# Altium project Brduino-Nano.PrjPcb
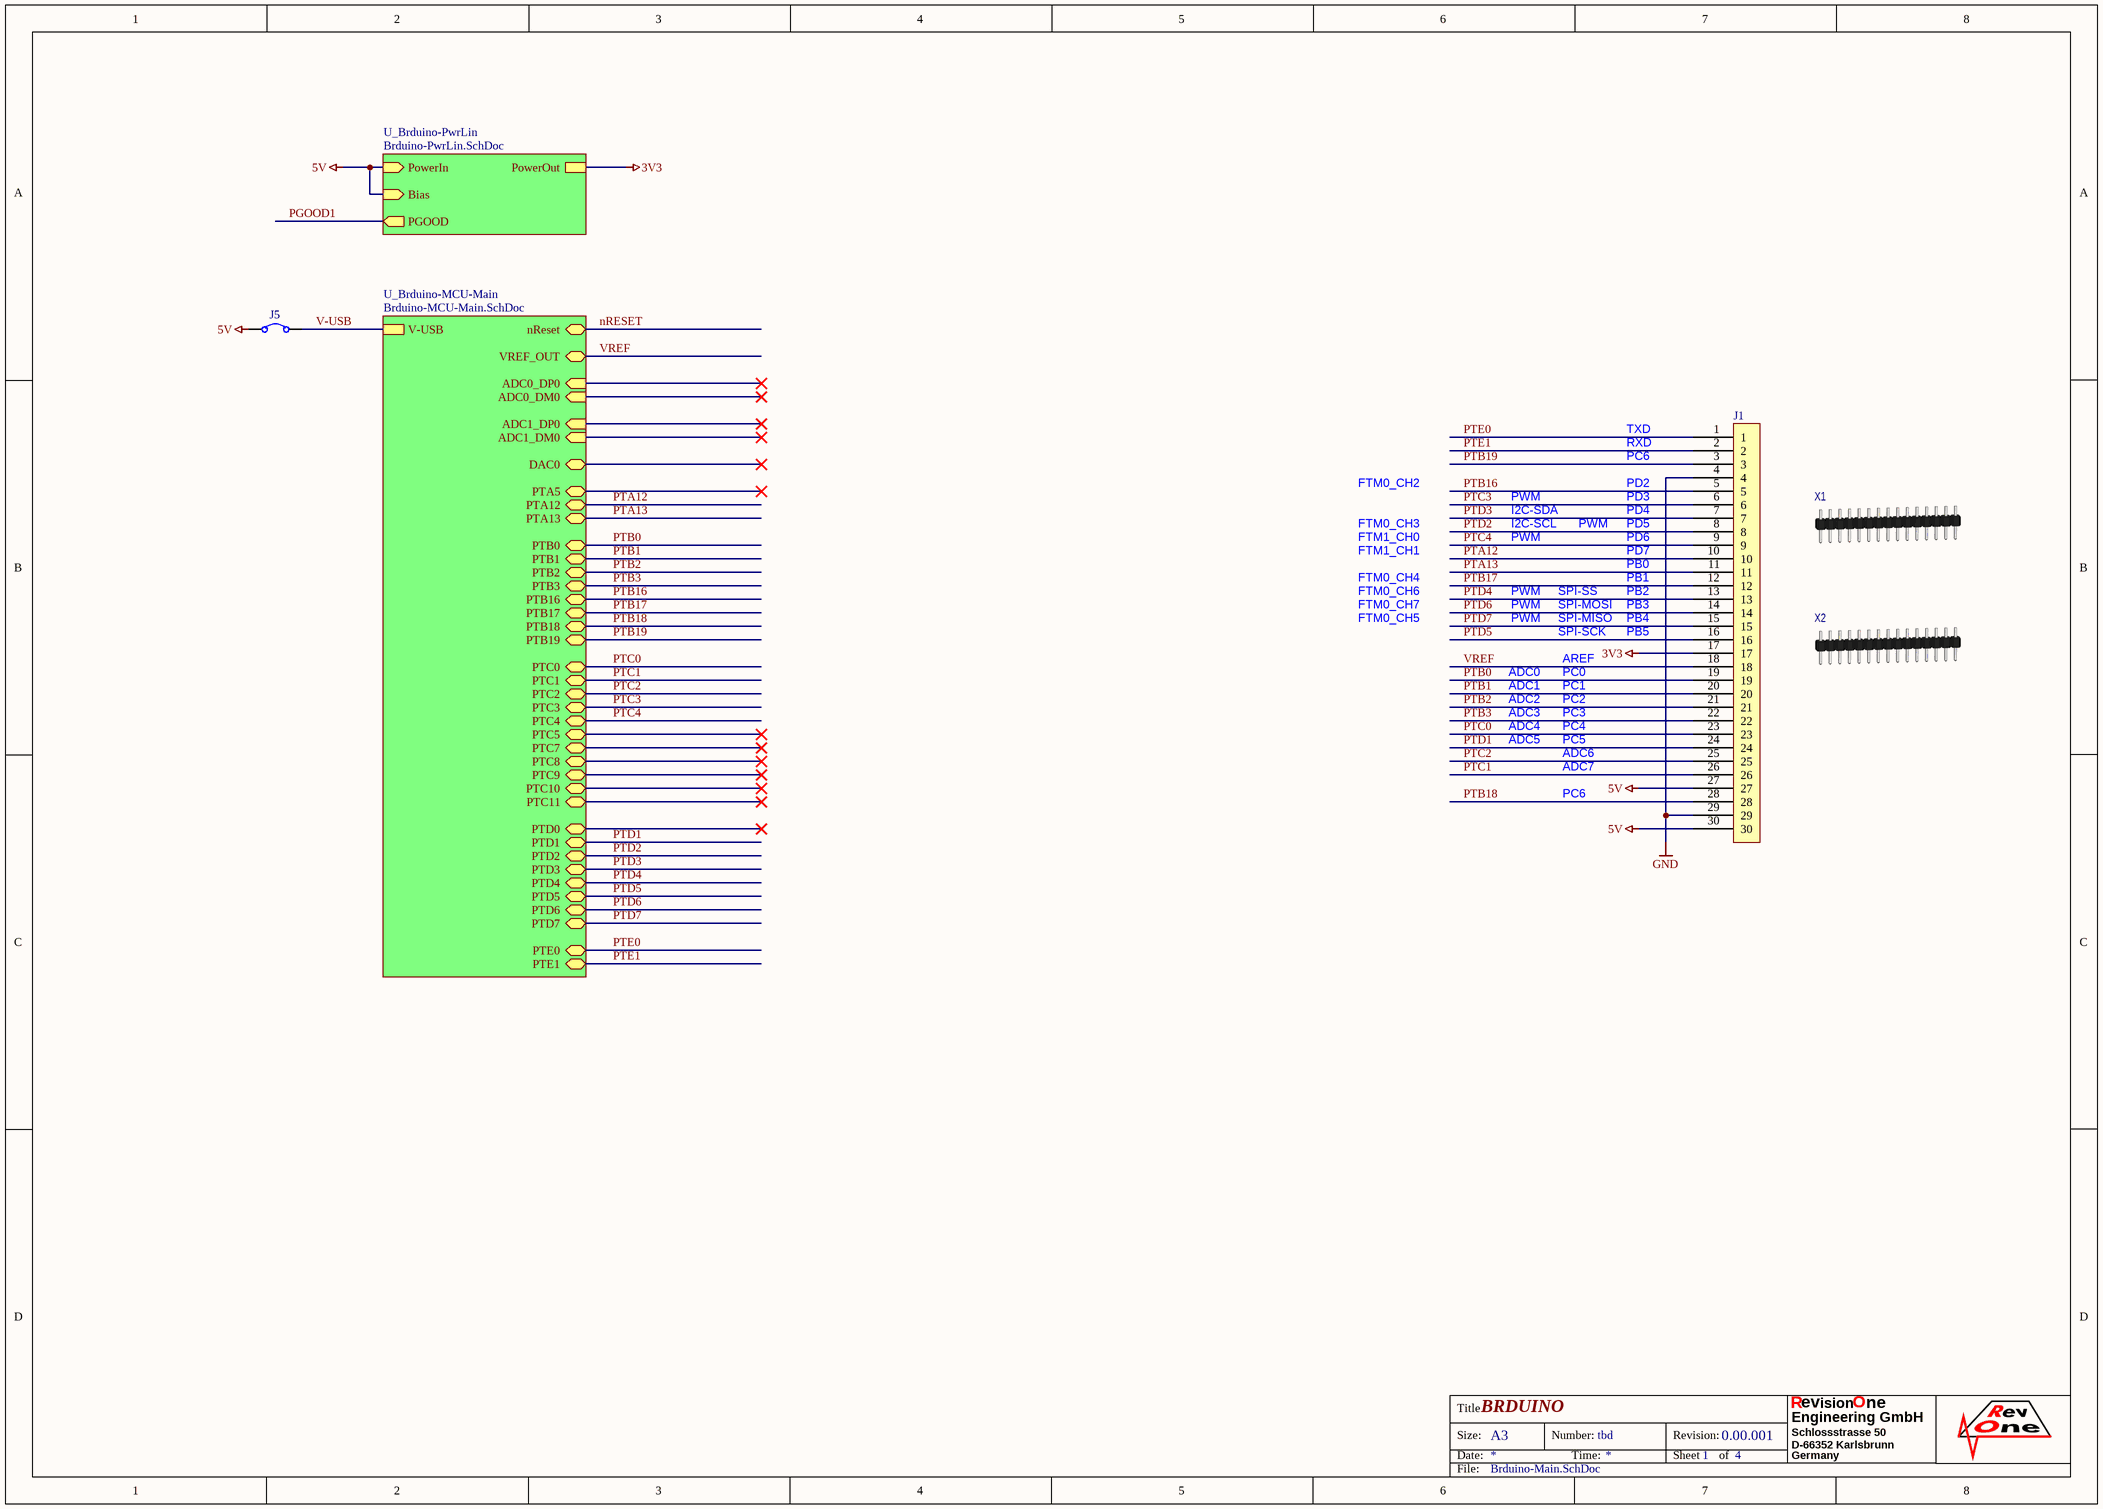
[diagram p0: Brduino-Main.SchDoc]
Project_CheckedBy: Hören; Project_DrawnBy: Mörz; Project_Engineer: Mörz; Project_Name: Brduino-Nano; Project_Number: U33115; Project_Repository: https://github.com/Semi-ATE/Brduino-Nano; Project_Revision: V1.1; project_Team: RevisionOne
4 sheets, 50 parts. Net scope: hierarchical (ports join the sheet entries above them; power ports are global).
Board file: Brduino-Nano.PcbDoc
Sheets:
  Brduino-Main.SchDoc
    U_Brduino-MCU-Main = Brduino-MCU-Main.SchDoc
      U_Brduino-MCU1 = Brduino-MCU1.SchDoc
    U_Brduino-PwrLin = Brduino-PwrLin.SchDoc

## Sheet Brduino-Main.SchDoc: BRDUINO
size A3; Organization: TDK Micronas; DocumentNumber: tbd; Revision: 0.00.001; SheetNumber: 1; SheetTotal: 4; Date: 8/14/2020; DrawnBy: Moerz; Engineer: Moerz

### Parts
J1  X  [ARDUINO-NANO]  (value not drawn)  (no BOM)
J5  R  [JumperSMD]  (value not drawn)
X1  X  (value not drawn)  (mechanical)
X2  X  (value not drawn)  (mechanical)

### Sub-sheets
U_Brduino-MCU-Main = Brduino-MCU-Main.SchDoc: PTD1 (bidir), PTC9 (bidir), PTA12 (bidir), PTB0 (bidir), PTD2 (bidir), PTD5 (bidir), ADC0_DP0 (in), PTA5 (bidir), PTC3 (bidir), DAC0 (bidir), PTC2 (bidir), PTC7 (bidir), PTD7 (bidir), PTC0 (bidir), PTC5 (bidir), ADC1_DP0 (in), PTB1 (bidir), PTB18 (bidir), PTD4 (bidir), PTB19 (bidir), PTB16 (bidir), nReset (bidir), PTB2 (bidir), ADC0_DM0 (in), PTD6 (bidir), VREF_OUT (bidir), PTE0 (bidir), PTD0 (bidir), PTC11 (bidir), PTE1 (bidir), PTC1 (bidir), PTC10 (bidir), PTC4 (bidir), PTB17 (bidir), PTB3 (bidir), ADC1_DM0 (in), PTC8 (bidir), PTA13 (bidir), PTD3 (bidir), V-USB
U_Brduino-PwrLin = Brduino-PwrLin.SchDoc: PowerOut, PowerIn (in), Bias (in), PGOOD (out)

### Nets
3V3: J1.17 ; sheet U_Brduino-PwrLin/PowerOut
5V: J1.27 J1.30 J5.1 ; sheet U_Brduino-PwrLin/PowerIn, sheet U_Brduino-PwrLin/Bias
GND: J1.4 J1.29
PTA12: J1.10 ; sheet U_Brduino-MCU-Main/PTA12
PTA13: J1.11 ; sheet U_Brduino-MCU-Main/PTA13
PTB0: J1.19 ; sheet U_Brduino-MCU-Main/PTB0
PTB1: J1.20 ; sheet U_Brduino-MCU-Main/PTB1
PTB2: J1.21 ; sheet U_Brduino-MCU-Main/PTB2
PTB3: J1.22 ; sheet U_Brduino-MCU-Main/PTB3
PTB16: J1.5 ; sheet U_Brduino-MCU-Main/PTB16
PTB17: J1.12 ; sheet U_Brduino-MCU-Main/PTB17
PTB18: J1.28 ; sheet U_Brduino-MCU-Main/PTB18
PTB19: J1.3 ; sheet U_Brduino-MCU-Main/PTB19
PTC0: J1.23 ; sheet U_Brduino-MCU-Main/PTC0
PTC1: J1.26 ; sheet U_Brduino-MCU-Main/PTC1
PTC2: J1.25 ; sheet U_Brduino-MCU-Main/PTC2
PTC3: J1.6 ; sheet U_Brduino-MCU-Main/PTC3
PTC4: J1.9 ; sheet U_Brduino-MCU-Main/PTC4
PTD1: J1.24 ; sheet U_Brduino-MCU-Main/PTD1
PTD2: J1.8 ; sheet U_Brduino-MCU-Main/PTD2
PTD3: J1.7 ; sheet U_Brduino-MCU-Main/PTD3
PTD4: J1.13 ; sheet U_Brduino-MCU-Main/PTD4
PTD5: J1.16 ; sheet U_Brduino-MCU-Main/PTD5
PTD6: J1.14 ; sheet U_Brduino-MCU-Main/PTD6
PTD7: J1.15 ; sheet U_Brduino-MCU-Main/PTD7
PTE0: J1.1 ; sheet U_Brduino-MCU-Main/PTE0
PTE1: J1.2 ; sheet U_Brduino-MCU-Main/PTE1
V-USB: J5.2 ; sheet U_Brduino-MCU-Main/V-USB
VREF: J1.18 ; sheet U_Brduino-MCU-Main/VREF_OUT

### Notes on the sheet
- TXD
- RXD
- FTM0_CH2
- PWM
- I2C-SDA
- PC6
- PD2
- PD3
- PD4
- FTM0_CH3
- FTM1_CH0
- FTM1_CH1
- FTM0_CH4
- I2C-SCL
- PD5
- PD6
- PD7
- PB0
- PB1
- FTM0_CH6
- FTM0_CH7
- FTM0_CH5
- SPI-SS
- SPI-MOSI
- SPI-MISO
- SPI-SCK
- PB2
- PB3
- PB4
- PB5
- ADC0
- ADC1
- ADC2
- ADC3
- PC0
- PC1
- PC2
- PC3
- AREF
- ADC4
- ADC5
- PC4
- PC5
- ADC6
- ADC7
- Title
- Size:
- Date:
- A3
- Number:
- Time:
- Revision:
- Sheet
- of
- R
- Schlossstrasse 50
- D-66352 Karlsbrunn
- Germany
- Engineering GmbH
- ev
- ision
- O
- ne
- File:

### Library data of the parts
J1 = ARDUINO-NANO-CON: 01. Distributor: DigiKey
J5 = Jumper: RES SMD 0 OHM JUMPER 1/10W 0603; 04. Manufacturer: Yageo; 05. Manufacturer PN: RC0603JR-070RL; POPULATED: yes; 03. Unit Price: 0.08; Value: 0R; 01. Distributor: DigiKey; 02. distributor PN: 311-0.0GRDKR-ND
X1 X2 = TSW-115-08-F-S: CONN HEADER VERT 15POS 2.54MM; 04. Manufacturer: Samtec Inc.; 05. Manufacturer PN: HTSW-115-08-F-S; 03. Unit Price: 1.03; POPULATED: yes; 01. Distributor: DigiKey; 02. distributor PN: HTSW-115-08-F-S-ND

## Sheet Brduino-MCU-Main.SchDoc: BRDUINO
size A3; Organization: TDK Micronas; DocumentNumber: tbd; Revision: 0.00.001; SheetNumber: 2; SheetTotal: 4; Date: 8/14/2020; DrawnBy: Moerz; Engineer: Moerz
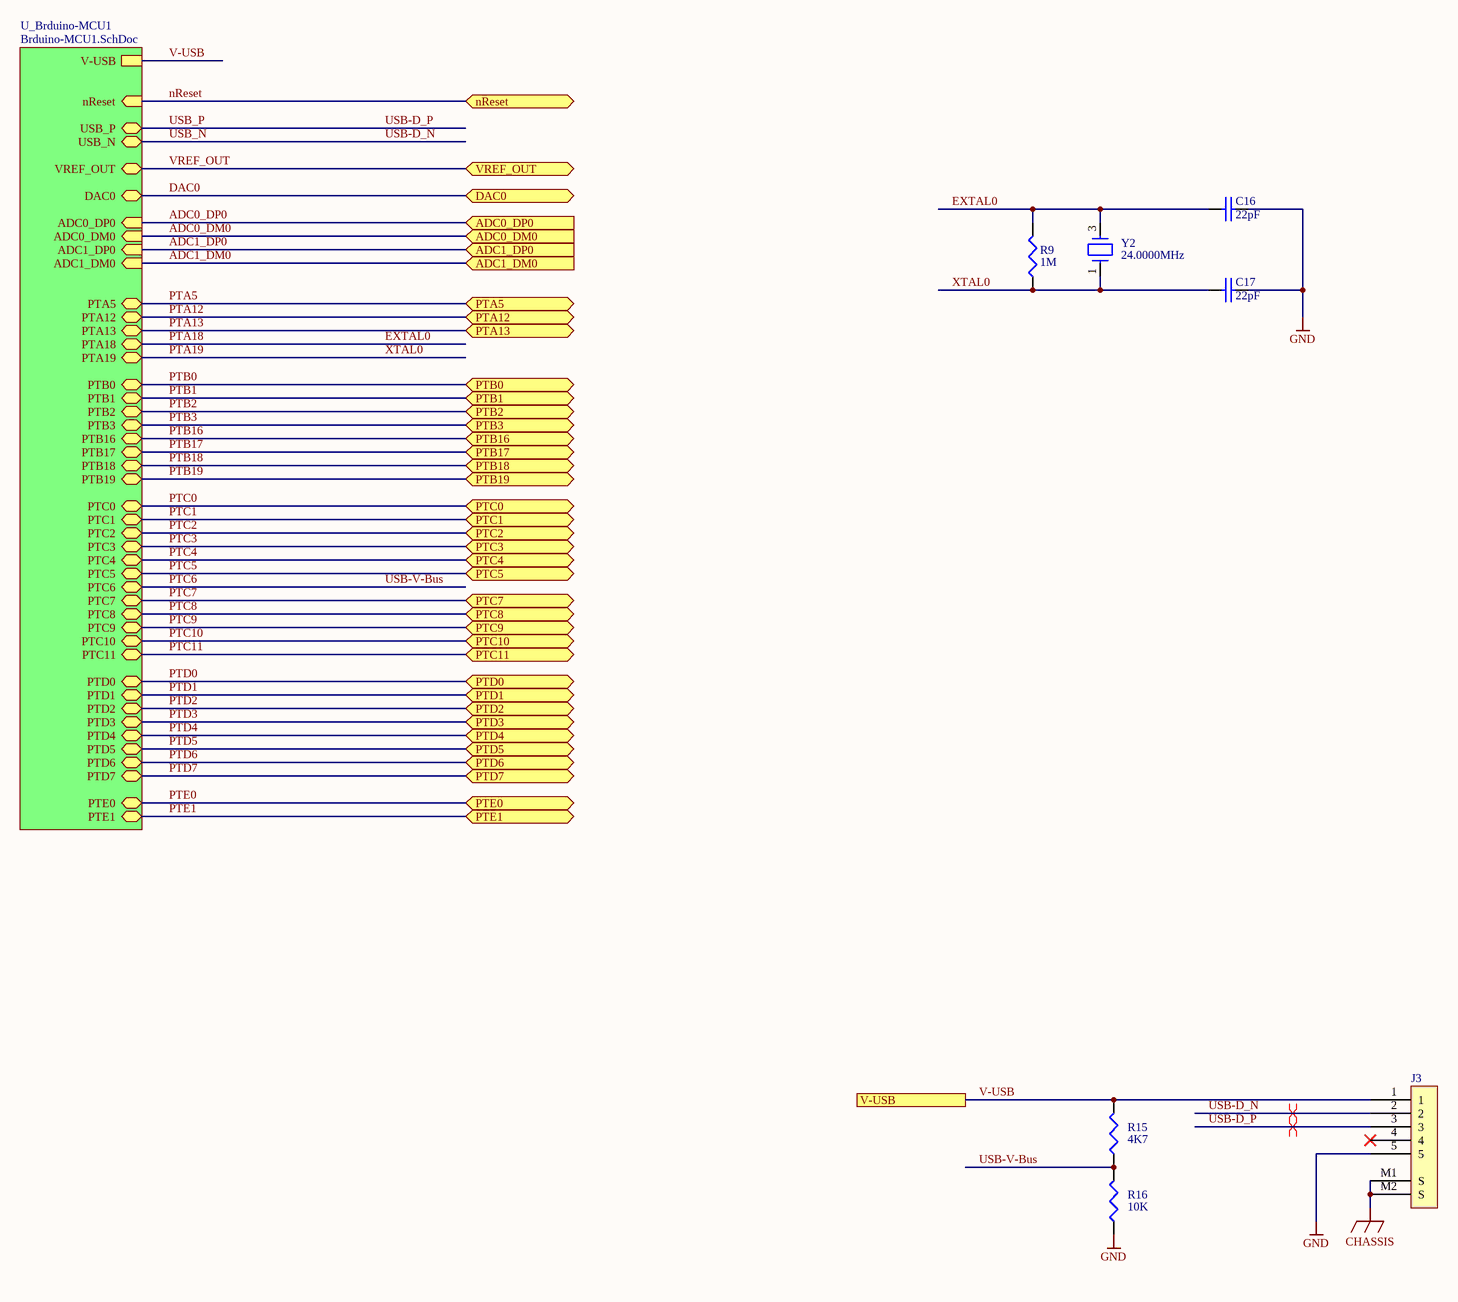
[diagram p1: Brduino-MCU-Main.SchDoc]

### Parts
C16  value 22pF  [C0402]  (hidden comment: C)
C17  value 22pF  [C0402]  (hidden comment: C)
J3  X  [Molex-0565790519]  (value not drawn)
R9  value 1M  [R0402]  (hidden comment: R)
R15  value 4K7  [R0402]  (hidden comment: R)
R16  value 10K  [R0402]  (hidden comment: R)
Y2  value 24.0000MHz  [FA-238]  (hidden comment: Y)

### Sub-sheets
U_Brduino-MCU1 = Brduino-MCU1.SchDoc: nReset (in), V-USB, PTE0 (bidir), PTE1 (bidir), PTA5 (bidir), PTA12 (bidir), PTA13 (bidir), PTA18 (bidir), PTA19 (bidir), PTB0 (bidir), PTB1 (bidir), PTB2 (bidir), PTB3 (bidir), PTB16 (bidir), PTB17 (bidir), PTB18 (bidir), PTB19 (bidir), PTC0 (bidir), PTC1 (bidir), PTC2 (bidir), PTC3 (bidir), PTC4 (bidir), PTC5 (bidir), PTC6 (bidir), PTC7 (bidir), PTC8 (bidir), PTC9 (bidir), PTC10 (bidir), PTC11 (bidir), PTD0 (bidir), PTD1 (bidir), PTD2 (bidir), PTD3 (bidir), PTD4 (bidir), PTD5 (bidir), PTD6 (bidir), PTD7 (bidir), ADC0_DP0 (in), ADC0_DM0 (in), ADC1_DP0 (in), ADC1_DM0 (in), VREF_OUT (bidir), DAC0 (bidir), USB_P (bidir), USB_N (bidir)

### Ports
ADC0_DM0 (in), ADC0_DP0 (in), ADC1_DM0 (in), ADC1_DP0 (in), DAC0 (bidir), nReset (bidir), PTA5 (bidir), PTA12 (bidir), PTA13 (bidir), PTB0 (bidir), PTB1 (bidir), PTB2 (bidir), PTB3 (bidir), PTB16 (bidir), PTB17 (bidir), PTB18 (bidir), PTB19 (bidir), PTC0 (bidir), PTC1 (bidir), PTC2 (bidir), PTC3 (bidir), PTC4 (bidir), PTC5 (bidir), PTC7 (bidir), PTC8 (bidir), PTC9 (bidir), PTC10 (bidir), PTC11 (bidir), PTD0 (bidir), PTD1 (bidir), PTD2 (bidir), PTD3 (bidir), PTD4 (bidir), PTD5 (bidir), PTD6 (bidir), PTD7 (bidir), PTE0 (bidir), PTE1 (bidir), V-USB, VREF_OUT (bidir)

### Nets
CHASSIS: J3.M1(S) J3.M2(S)
GND: C16.2 C17.2 J3.5 R16.1
ADC0_DM0: port ADC0_DM0, sheet U_Brduino-MCU1/ADC0_DM0
ADC0_DP0: port ADC0_DP0, sheet U_Brduino-MCU1/ADC0_DP0
ADC1_DM0: port ADC1_DM0, sheet U_Brduino-MCU1/ADC1_DM0
ADC1_DP0: port ADC1_DP0, sheet U_Brduino-MCU1/ADC1_DP0
DAC0: port DAC0, sheet U_Brduino-MCU1/DAC0
EXTAL0: C16.1 R9.2 Y2.3 ; sheet U_Brduino-MCU1/PTA18  [also labelled PTA18]
nRESET: port nReset, sheet U_Brduino-MCU1/nReset
PTA5: port PTA5, sheet U_Brduino-MCU1/PTA5
PTA12: port PTA12, sheet U_Brduino-MCU1/PTA12
PTA13: port PTA13, sheet U_Brduino-MCU1/PTA13
PTA19: C17.1 R9.1 Y2.1 ; sheet U_Brduino-MCU1/PTA19  [also labelled XTAL0]
PTB0: port PTB0, sheet U_Brduino-MCU1/PTB0
PTB1: port PTB1, sheet U_Brduino-MCU1/PTB1
PTB2: port PTB2, sheet U_Brduino-MCU1/PTB2
PTB3: port PTB3, sheet U_Brduino-MCU1/PTB3
PTB16: port PTB16, sheet U_Brduino-MCU1/PTB16
PTB17: port PTB17, sheet U_Brduino-MCU1/PTB17
PTB18: port PTB18, sheet U_Brduino-MCU1/PTB18
PTB19: port PTB19, sheet U_Brduino-MCU1/PTB19
PTC0: port PTC0, sheet U_Brduino-MCU1/PTC0
PTC1: port PTC1, sheet U_Brduino-MCU1/PTC1
PTC2: port PTC2, sheet U_Brduino-MCU1/PTC2
PTC3: port PTC3, sheet U_Brduino-MCU1/PTC3
PTC4: port PTC4, sheet U_Brduino-MCU1/PTC4
PTC5: port PTC5, sheet U_Brduino-MCU1/PTC5
PTC6: R15.1 R16.2 ; sheet U_Brduino-MCU1/PTC6  [also labelled USB-V-Bus]
PTC7: port PTC7, sheet U_Brduino-MCU1/PTC7
PTC8: port PTC8, sheet U_Brduino-MCU1/PTC8
PTC9: port PTC9, sheet U_Brduino-MCU1/PTC9
PTC10: port PTC10, sheet U_Brduino-MCU1/PTC10
PTC11: port PTC11, sheet U_Brduino-MCU1/PTC11
PTD0: port PTD0, sheet U_Brduino-MCU1/PTD0
PTD1: port PTD1, sheet U_Brduino-MCU1/PTD1
PTD2: port PTD2, sheet U_Brduino-MCU1/PTD2
PTD3: port PTD3, sheet U_Brduino-MCU1/PTD3
PTD4: port PTD4, sheet U_Brduino-MCU1/PTD4
PTD5: port PTD5, sheet U_Brduino-MCU1/PTD5
PTD6: port PTD6, sheet U_Brduino-MCU1/PTD6
PTD7: port PTD7, sheet U_Brduino-MCU1/PTD7
PTE0: port PTE0, sheet U_Brduino-MCU1/PTE0
PTE1: port PTE1, sheet U_Brduino-MCU1/PTE1
USB-D_N: J3.2 ; sheet U_Brduino-MCU1/USB_N  [also labelled USB_N]
USB-D_P: J3.3 ; sheet U_Brduino-MCU1/USB_P  [also labelled USB_P]
V-USB: J3.1 R15.2 ; port V-USB, sheet U_Brduino-MCU1/V-USB
VREF_OUT: port VREF_OUT, sheet U_Brduino-MCU1/VREF_OUT  [project net VREF]

Not connected (* = marked no-connect by the designer): J3 4*

### Layout directives
differential pair: USB-D_N, USB-D_P

### Notes on the sheet
- Title
- Size:
- Date:
- A3
- Number:
- Time:
- Revision:
- Sheet
- of
- R
- Schlossstrasse 50
- D-66352 Karlsbrunn
- Germany
- Engineering GmbH
- ev
- ision
- O
- ne
- File:

### Library data of the parts
C16 C17 = CAP: CAP CER 22PF 16V C0G/NP0 0402; 04. Manufacturer: KEMET; 05. Manufacturer PN: C0402C220J4GACTU; POPULATED: yes; Parameters: X7R, 25V, 10%; 03. Unit Price: 0.08; 01. Distributor: DigiKey; 02. distributor PN: 399-8954-6-ND
J3 = MICRO-USB: CONN RCPT USB2.0 MINI AB 5P R/A; 04. Manufacturer: Molex; 05. Manufacturer PN: 0565790519; POPULATED: yes; 03. Unit Price: 2.04; 01. Distributor: DigiKey; 02. distributor PN: WM17121-ND
R9 = RES1A: RES SMD 1M OHM 1% 1/16W 0402; 04. Manufacturer: Yageo; 05. Manufacturer PN: RC0402FR-071ML; POPULATED: yes; Parameters: 1/16W, 50V, 1%; 03. Unit Price: 0.08; 01. Distributor: DigiKey; 02. distributor PN: 311-1.00MLRDKR-ND
R15 = RES1A: RES SMD 4.7K OHM 1% 1/16W 0402; 04. Manufacturer: Yageo; 05. Manufacturer PN: RC0402FR-074K7L; POPULATED: yes; Parameters: 1/16W, 50V, 1%; 03. Unit Price: 0.08; 01. Distributor: DigiKey; 02. distributor PN: 311-4.7KLRDKR-ND
R16 = RES1A: RES SMD 10K OHM 1% 1/16W 0402; 04. Manufacturer: Yageo; 05. Manufacturer PN: RC0402FR-0710KL; POPULATED: yes; Parameters: 1/16W, 50V, 1%; 03. Unit Price: 0.08; 01. Distributor: DigiKey; 02. distributor PN: 311-10.0KLRDKR-ND
Y2 = FA-238: CRYSTAL 24.0000MHZ 18PF SMD; 04. Manufacturer: EPSON; 05. Manufacturer PN: FA-238 24.0000MB-C3; Parameters: -20°C/+70°C, 50ppm, 18pF, 60ohms; POPULATED: yes; 03. Unit Price: 0.30; 01. Distributor: DigiKey; 02. distributor PN: SER3689DKR-ND

## Sheet Brduino-MCU1.SchDoc: BRDUINO
size A3; Organization: TDK Micronas; DocumentNumber: tbd; Revision: 0.00.001; SheetNumber: 3; SheetTotal: 4; Date: 8/14/2020; DrawnBy: Moerz; Engineer: Moerz
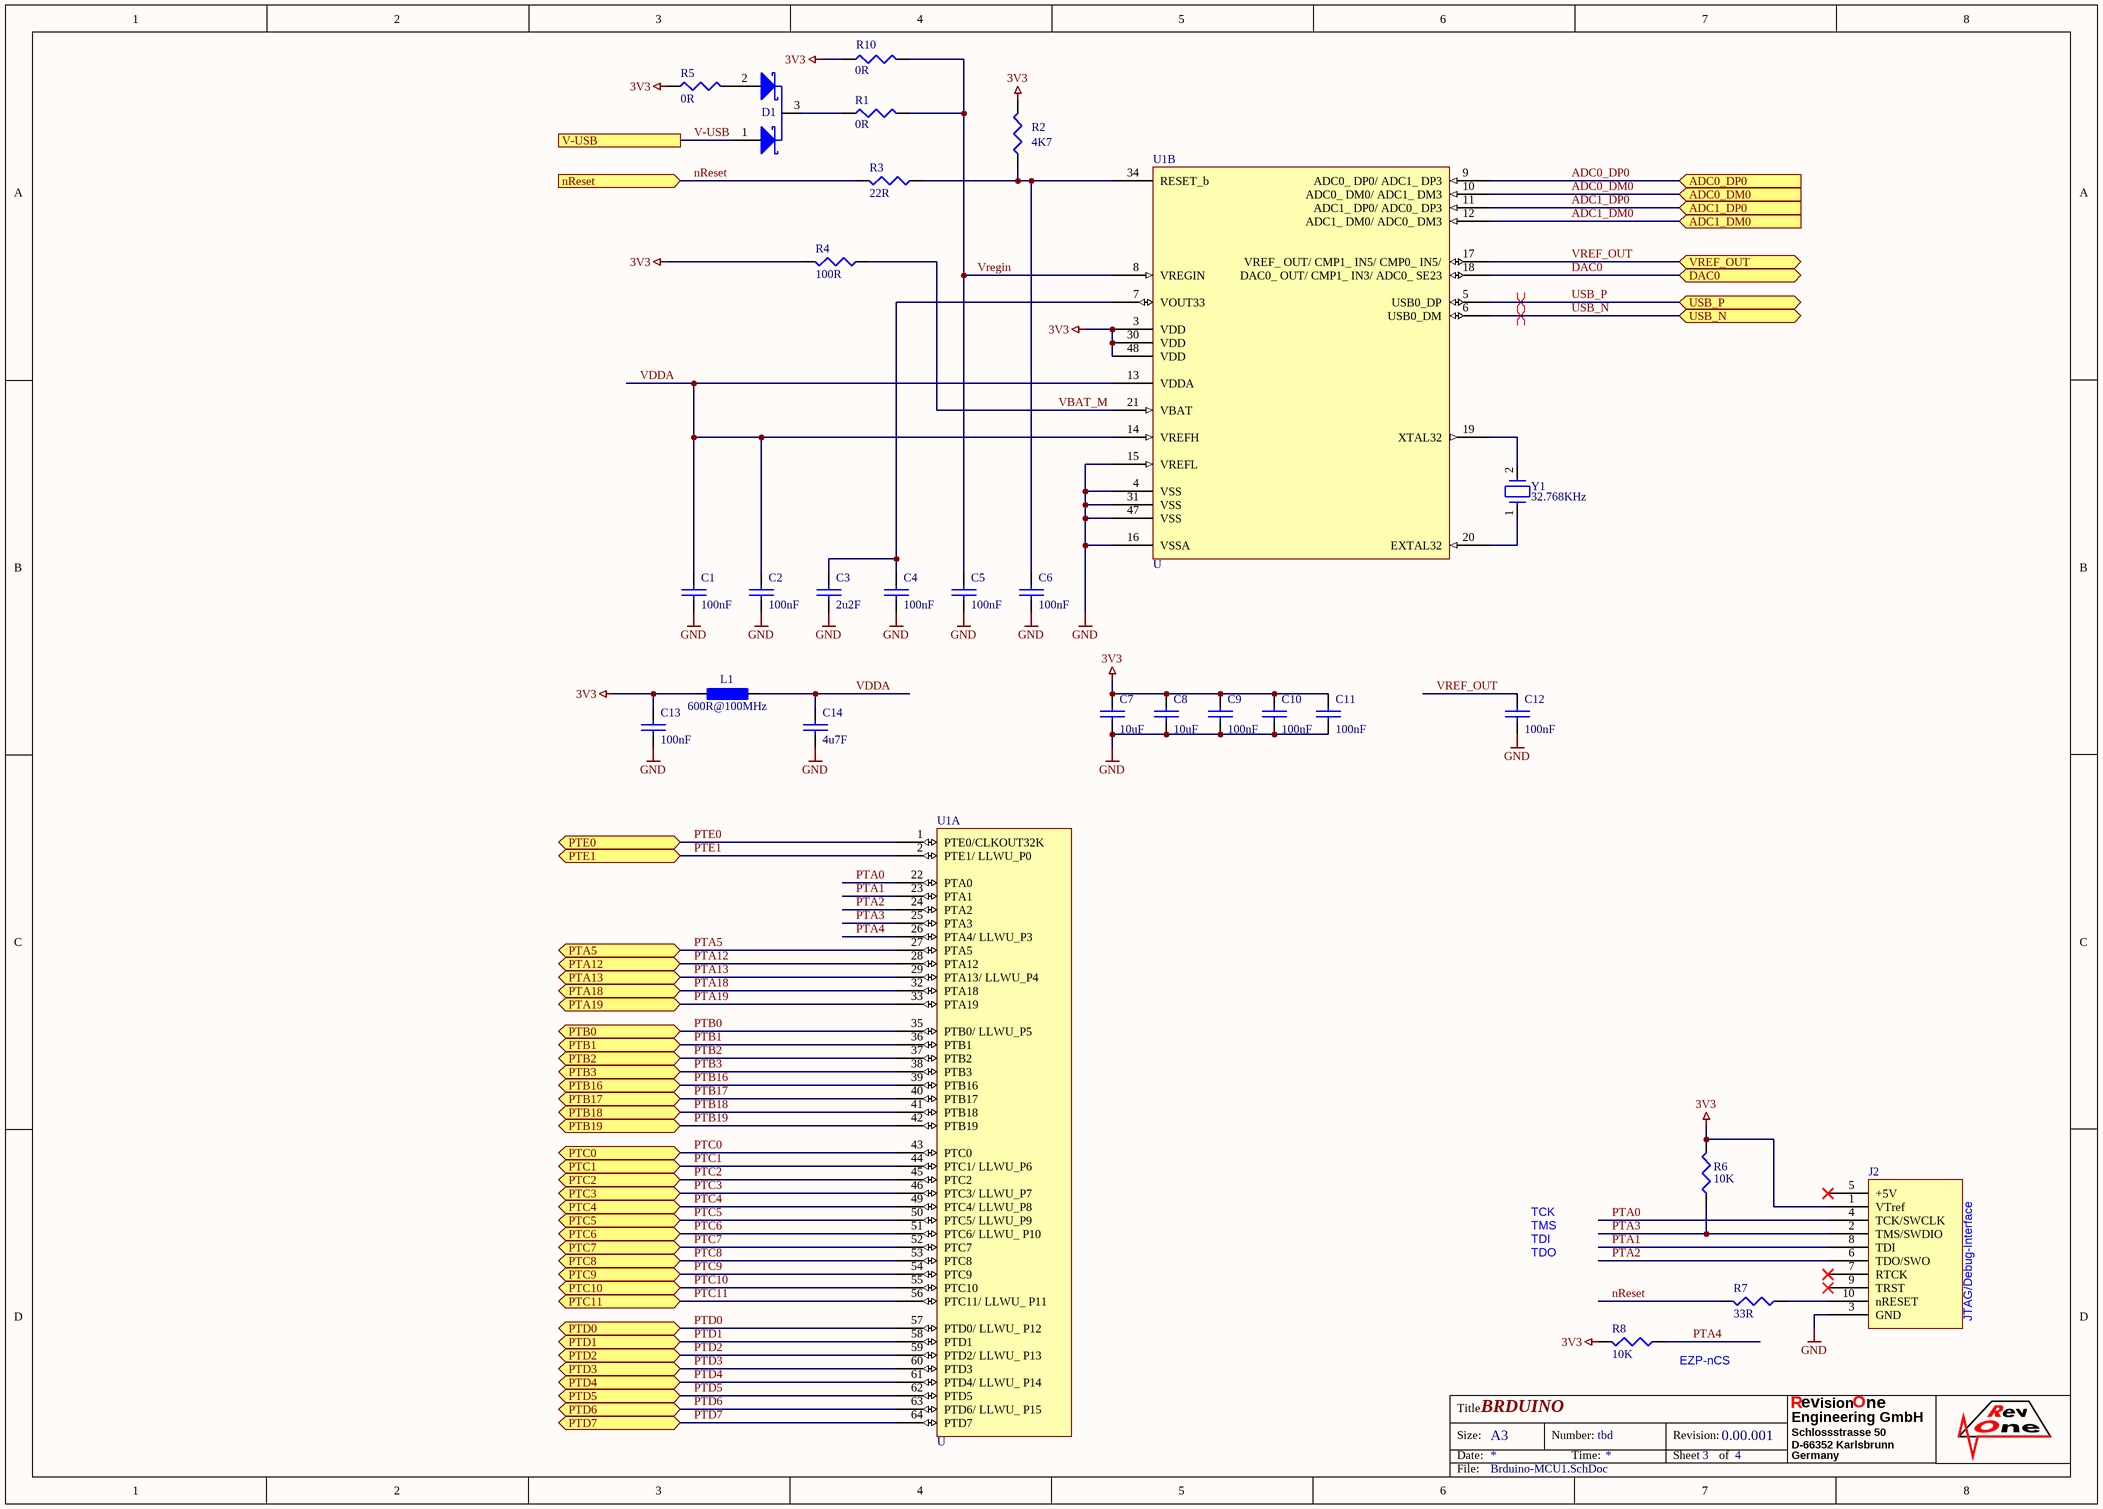
[diagram p2: Brduino-MCU1.SchDoc]

### Parts
C1  value 100nF  [C0402]  (hidden comment: C)
C2  value 100nF  [C0402]  (hidden comment: C)
C3  value 2u2F  [C0603]  (hidden comment: C)
C4  value 100nF  [C0402]  (hidden comment: C)
C5  value 100nF  [C0402]  (hidden comment: C)
C6  value 100nF  [C0402]  (hidden comment: C)
C7  value 10uF  [C0805]  (hidden comment: C)
C8  value 10uF  [C0805]  (hidden comment: C)
C9  value 100nF  [C0402]  (hidden comment: C)
C10  value 100nF  [C0402]  (hidden comment: C)
C11  value 100nF  [C0402]  (hidden comment: C)
C12  value 100nF  [C0402]  (hidden comment: C)
C13  value 100nF  [C0402]  (hidden comment: C)
C14  value 4u7F  [C0805]  (hidden comment: C)
D1  D  [SOT23]  (value not drawn)
J2  X  [JLINK-NEEDLE]  (value not drawn)  (no BOM)
L1  value 600R@100MHz  [L0805]  (hidden comment: L)
R1  value 0R  [R0402]  (hidden comment: R)
R2  value 4K7  [R0402]  (hidden comment: R)
R3  value 22R  [R0402]  (hidden comment: R)
R4  value 100R  [R0402]  (hidden comment: R)
R5  value 0R  [R0402]  (hidden comment: R)
R6  value 10K  [R0402]  (hidden comment: R)
R7  value 33R  [R0402]  (hidden comment: R)
R8  value 10K  [R0402]  (hidden comment: R)
R10  value 0R  [R0402]  (hidden comment: R)
U1  U  [NXP-SOT1699-1]  (parts A,B of 2)
Y1  value 32.768KHz  [CM7V-T1A]  (hidden comment: Y)

### Ports
ADC0_DM0 (in), ADC0_DP0 (in), ADC1_DM0 (in), ADC1_DP0 (in), DAC0 (bidir), nReset (in), PTA5 (bidir), PTA12 (bidir), PTA13 (bidir), PTA18 (bidir), PTA19 (bidir), PTB0 (bidir), PTB1 (bidir), PTB2 (bidir), PTB3 (bidir), PTB16 (bidir), PTB17 (bidir), PTB18 (bidir), PTB19 (bidir), PTC0 (bidir), PTC1 (bidir), PTC2 (bidir), PTC3 (bidir), PTC4 (bidir), PTC5 (bidir), PTC6 (bidir), PTC7 (bidir), PTC8 (bidir), PTC9 (bidir), PTC10 (bidir), PTC11 (bidir), PTD0 (bidir), PTD1 (bidir), PTD2 (bidir), PTD3 (bidir), PTD4 (bidir), PTD5 (bidir), PTD6 (bidir), PTD7 (bidir), PTE0 (bidir), PTE1 (bidir), USB_N (bidir), USB_P (bidir), V-USB, VREF_OUT (bidir)

### Nets
3V3: C7.1 C8.1 C9.1 C10.1 C11.1 C13.2 J2.1(VTref) L1.1 R2.2 R4.2 R5.1 R6.2 R8.2 R10.1 U1.3(VDD) U1.30(VDD) U1.48(VDD)
GND: C1.2 C2.2 C3.2 C4.2 C5.2 C6.2 C7.2 C8.2 C9.2 C10.2 C11.2 C12.2 C13.1 C14.1 J2.3(GND) U1.4(VSS) U1.15(VREFL) U1.16(VSSA) U1.31(VSS) U1.47(VSS)
ADC0_DM0: U1.10(ADC0__DM0/_ADC1__DM3) ; port ADC0_DM0
ADC0_DP0: U1.9(ADC0__DP0/_ADC1__DP3) ; port ADC0_DP0
ADC1_DM0: U1.12(ADC1__DM0/_ADC0__DM3) ; port ADC1_DM0
ADC1_DP0: U1.11(ADC1__DP0/_ADC0__DP3) ; port ADC1_DP0
DAC0: U1.18(DAC0__OUT/_CMP1__IN3/_ADC0__SE23) ; port DAC0
nRESET: R3.2 R7.2 ; port nReset
PTA0: J2.4(TCK/SWCLK) U1.22(PTA0)  [project net PTA0_3]
PTA1: J2.8(TDI) U1.23(PTA1)  [project net PTA1_3]
PTA2: J2.6(TDO/SWO) U1.24(PTA2)  [project net PTA2_3]
PTA3: J2.2(TMS/SWDIO) R6.1 U1.25(PTA3)  [project net PTA3_3]
PTA4: R8.1 U1.26(PTA4/_LLWU_P3)  [project net PTA4_3]
PTA5: U1.27(PTA5) ; port PTA5
PTA12: U1.28(PTA12) ; port PTA12
PTA13: U1.29(PTA13/_LLWU_P4) ; port PTA13
PTA18: U1.32(PTA18) ; port PTA18  [project net EXTAL0]
PTA19: U1.33(PTA19) ; port PTA19
PTB0: U1.35(PTB0/_LLWU_P5) ; port PTB0
PTB1: U1.36(PTB1) ; port PTB1
PTB2: U1.37(PTB2) ; port PTB2
PTB3: U1.38(PTB3) ; port PTB3
PTB16: U1.39(PTB16) ; port PTB16
PTB17: U1.40(PTB17) ; port PTB17
PTB18: U1.41(PTB18) ; port PTB18
PTB19: U1.42(PTB19) ; port PTB19
PTC0: U1.43(PTC0) ; port PTC0
PTC1: U1.44(PTC1/_LLWU_P6) ; port PTC1
PTC2: U1.45(PTC2) ; port PTC2
PTC3: U1.46(PTC3/_LLWU_P7) ; port PTC3
PTC4: U1.49(PTC4/_LLWU_P8) ; port PTC4
PTC5: U1.50(PTC5/_LLWU_P9) ; port PTC5
PTC6: U1.51(PTC6/_LLWU__P10) ; port PTC6
PTC7: U1.52(PTC7) ; port PTC7
PTC8: U1.53(PTC8) ; port PTC8
PTC9: U1.54(PTC9) ; port PTC9
PTC10: U1.55(PTC10) ; port PTC10
PTC11: U1.56(PTC11/_LLWU__P11) ; port PTC11
PTD0: U1.57(PTD0/_LLWU__P12) ; port PTD0
PTD1: U1.58(PTD1) ; port PTD1
PTD2: U1.59(PTD2/_LLWU__P13) ; port PTD2
PTD3: U1.60(PTD3) ; port PTD3
PTD4: U1.61(PTD4/_LLWU__P14) ; port PTD4
PTD5: U1.62(PTD5) ; port PTD5
PTD6: U1.63(PTD6/_LLWU__P15) ; port PTD6
PTD7: U1.64(PTD7) ; port PTD7
PTE0: U1.1(PTE0/CLKOUT32K) ; port PTE0
PTE1: U1.2(PTE1/_LLWU_P0) ; port PTE1
USB_N: U1.6(USB0_DM) ; port USB_N  [project net USB-D_N]
USB_P: U1.5(USB0_DP) ; port USB_P  [project net USB-D_P]
V-USB: D1.1(A) ; port V-USB
VBAT_M: R4.1 U1.21(VBAT)  [project net VBAT_M_3]
VDDA: C1.1 C2.1 C14.2 L1.2 U1.13(VDDA) U1.14(VREFH)  [project net VDDA_3]
VREF_OUT: C12.1 U1.17(VREF__OUT/_CMP1__IN5/_CMP0__IN5/) ; port VREF_OUT  [project net VREF]
Vregin: C5.1 R1.2 R10.2 U1.8(VREGIN)  [project net Vregin_3]
NetC3_1: C3.1 C4.1 U1.7(VOUT33)
NetC6_1: C6.1 R2.1 R3.1 U1.34(RESET_b)
NetD1_2: D1.2(K) R5.2
NetD1_3: D1.3(C) R1.1
NetJ2_10: J2.10(nRESET) R7.1
NetU1_19: U1.19(XTAL32) Y1.2
NetU1_20: U1.20(EXTAL32) Y1.1

Not connected (* = marked no-connect by the designer): J2 5(+5V)* 7(RTCK)* 9(TRST)*

### Layout directives
differential pair: USB-D_N, USB-D_P

### Notes on the sheet
- TCK
- TDI
- TDO
- TMS
- JTAG/Debug-Interface
- (near R8) EZP-nCS
- Title
- Size:
- Date:
- A3
- Number:
- Time:
- Revision:
- Sheet
- of
- R
- Schlossstrasse 50
- D-66352 Karlsbrunn
- Germany
- Engineering GmbH
- ev
- ision
- O
- ne
- File:

### Library data of the parts
C1 C2 C4-C6 C9-C13 = CAP: CAP CER 0.1UF 25V X7R 0402; 04. Manufacturer: Yageo; 05. Manufacturer PN: CC0402KRX7R8BB104; POPULATED: yes; Parameters: X7R, 25V, 10%; 03. Unit Price: 0.08; 01. Distributor: DigiKey; 02. distributor PN: 311-2077-6-ND
C3 = CAP: CAP CER 2.2UF 10V X5R 0603; 04. Manufacturer: Samsung Electro-Mechanics; 05. Manufacturer PN: CL10A225KP8NNNC; POPULATED: yes; Parameters: X7R, 25V, 10%; 03. Unit Price: 0.08; 01. Distributor: DigiKey; 02. distributor PN: 1276-1085-6-ND
C7 C8 = CAP: CAP CER 10UF 10V X7R 0805; 04. Manufacturer: Murata Electronics; 05. Manufacturer PN: GRM21BR71A106KA73L; POPULATED: yes; Parameters: X7R, 25V, 10%; 03. Unit Price: 0.21; 01. Distributor: DigiKey; 02. distributor PN: 490-10516-6-ND
C14 = CAP: CAP CER 4.7UF 10V X7R 0805; 04. Manufacturer: Samsung Electro-Mechanics; 05. Manufacturer PN: CL21B475KPFNNNE; POPULATED: yes; Parameters: X7R, 25V, 10%; 03. Unit Price: 0.21; 01. Distributor: DigiKey; 02. distributor PN: 1276-2972-6-ND
D1 = DUALSDIODE-CC: DIODE ARRAY SCHOTTKY 30V SOT23-3; 04. Manufacturer: ONSEMI; 05. Manufacturer PN: BAT54C; POPULATED: yes; 03. Unit Price: 0.18; 01. Distributor: DigiKey; 02. distributor PN: BAT54CFSCT-ND
J2 = JLINK-NEEDLE: 01. Distributor: DigiKey
L1 = FERRITE: FERRITE BEAD 600 OHM 0805 1LN; 04. Manufacturer: WUERTH; 05. Manufacturer PN: 742792040; Parameters: Idc=2A, Rdc=0.15R; POPULATED: yes; 03. Unit Price: 0.18; 01. Distributor: DigiKey; 02. distributor PN: 732-1620-6-ND
R1 R5 R10 = RES1A: RES SMD 0 OHM JUMPER 1/16W 0402; 04. Manufacturer: Yageo; 05. Manufacturer PN: RC0402JR-070RL; POPULATED: yes; Parameters: 1/16W, 50V, 1%; 03. Unit Price: 0.08; 01. Distributor: DigiKey; 02. distributor PN: 311-0.0JRDKR-ND
R2 = RES1A: as R15 on sheet Brduino-MCU-Main; 01. Distributor: DigiKey; 02. distributor PN: 311-4.7KLRDKR-ND
R3 = RES1A: RES SMD 22 OHM 1% 1/16W 0402; 04. Manufacturer: Yageo; 05. Manufacturer PN: RC0402FR-0722RL; POPULATED: yes; Parameters: 1/16W, 50V, 1%; 03. Unit Price: 0.08; 01. Distributor: DigiKey; 02. distributor PN: 311-22.0LRDKR-ND
R4 = RES1A: RES SMD 100 OHM 1% 1/16W 0402; 04. Manufacturer: Yageo; 05. Manufacturer PN: RC0402FR-07100RL; POPULATED: yes; Parameters: 1/16W, 50V, 1%; 03. Unit Price: 0.08; 01. Distributor: DigiKey; 02. distributor PN: 311-100LRDKR-ND
R6 R8 = RES1A: as R16 on sheet Brduino-MCU-Main; 01. Distributor: DigiKey; 02. distributor PN: 311-10.0KLRDKR-ND
R7 = RES1A: RES SMD 33 OHM 1% 1/16W 0402; 04. Manufacturer: Yageo; 05. Manufacturer PN: RC0402FR-0733RL; POPULATED: yes; Parameters: 1/16W, 50V, 1%; 03. Unit Price: 0.08; 01. Distributor: DigiKey; 02. distributor PN: 311-33.0LRDKR-ND
U1 = MK22FN512VLH12: IC MCU 32BIT 512KB FLASH 64LQFP; 04. Manufacturer: NXP USA Inc.; POPULATED: yes; 03. Unit Price: 7.16; 01. Distributor: DigiKey; 05. Manufacturer PN: MK22FN512VLH12; 02. distributor PN: MK22FN512VLH12-ND
Y1 = CM7V-T1A: Crystals 32.768 kHz 9.0 pF +/-20 PPM; 04. Manufacturer: Micro Crystal; 05. Manufacturer PN: CM7V-T1A-32.768k-9pF-20PPM-TA-QA T3; POPULATED: yes; 03. Unit Price: 0.37; 01. Distributor: Mouser; 02. distributor PN: 428-201568-MG03

## Sheet Brduino-PwrLin.SchDoc: BRDUINO
size A3; Organization: TDK Micronas; DocumentNumber: tbd; Revision: 0.00.001; SheetNumber: 4; SheetTotal: 4; Date: 8/14/2020; DrawnBy: Moerz; Engineer: Moerz
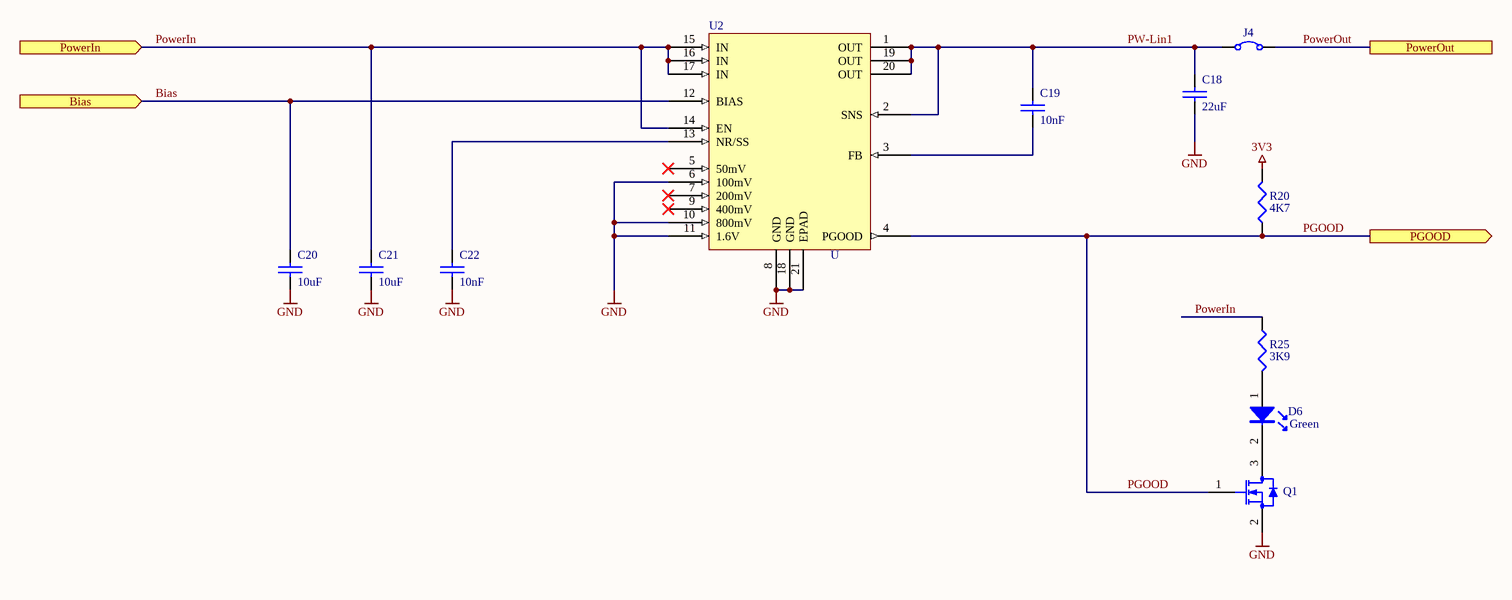
[diagram p3: Brduino-PwrLin.SchDoc]

### Parts
C18  value 22uF  [C0805]  (hidden comment: C)
C19  value 10nF  [C0402]  (hidden comment: C)
C20  value 10uF  [C0805]  (hidden comment: C)
C21  value 10uF  [C0805]  (hidden comment: C)
C22  value 10nF  [C0402]  (hidden comment: C)
D6  value Green  [LED0603]  (hidden comment: D)
J4  R  [JumperSMD]  (value not drawn)
Q1  Q  [SOT323]  (value not drawn)
R20  value 4K7  [R0402]  (hidden comment: R)
R25  value 3K9  [R0402]  (hidden comment: R)
U2  U  [S-PVQFN-N20]

### Ports
Bias (in), PGOOD (out), PowerIn (in), PowerOut

### Nets
3V3: J4.2 R20.2 ; port PowerOut  [also labelled PowerOut]
Bias: C20.2 C21.2 R25.1 U2.12(BIAS) U2.14(EN) U2.15(IN) U2.16(IN) U2.17(IN) ; port PowerIn, port Bias  [also labelled PowerIn]  [project net 5V]
GND: C18.1 C20.1 C21.1 C22.2 Q1.2(S) U2.6(100mV) U2.8(GND) U2.10(800mV) U2.11(1.6V) U2.18(GND) U2.21(EPAD)
PGOOD: Q1.1(G) R20.1 U2.4(PGOOD) ; port PGOOD  [project net PGOOD1]
PW-Lin1: C18.2 C19.1 J4.1 U2.1(OUT) U2.2(SNS) U2.19(OUT) U2.20(OUT)  [project net PW-Lin1_4]
NetC19_2: C19.2 U2.3(FB)
NetC22_1: C22.1 U2.13(NR/SS)
NetD6_1: D6.1(A) R25.2
NetD6_2: D6.2(K) Q1.3(D)

Not connected (* = marked no-connect by the designer): U2 5(50mV)* 7(200mV)* 9(400mV)*

### Notes on the sheet
- Title
- Size:
- Date:
- A3
- Number:
- Time:
- Revision:
- Sheet
- of
- R
- Schlossstrasse 50
- D-66352 Karlsbrunn
- Germany
- Engineering GmbH
- ev
- ision
- O
- ne
- File:

### Library data of the parts
C18 = CAP: CAP CER 22UF 10V X5R 0805; 04. Manufacturer: Murata Electronics; 05. Manufacturer PN: GRM21BR61A226ME44#; Parameters: X7R, 25V, 10%; POPULATED: yes; 03. Unit Price: 0.49; 01. Distributor: DigiKey; 02. distributor PN: 490-10746-6-ND
C19 C22 = CAP: CAP CER 10000PF 50V X7R 0402; 04. Manufacturer: Murata Electronics; 05. Manufacturer PN: GRM155R71H103KA88D; POPULATED: yes; Parameters: X7R, 25V, 10%; 03. Unit Price: 0.08; 01. Distributor: DigiKey; 02. distributor PN: 490-4516-6-ND
C20 C21 = CAP: CAP CER 10UF 25V X5R 0805; 04. Manufacturer: Murata Electronics; 05. Manufacturer PN: GRM21BR61E106KA73L; Parameters: X7R, 25V, 10%; POPULATED: yes; 03. Unit Price: 0.37; 01. Distributor: DigiKey; 02. distributor PN: 490-5523-6-ND
D6 = LED: LED GREEN CLEAR 1608 SMD; 04. Manufacturer: KINGBRIGHT; 05. Manufacturer PN: APHD1608LCGCK; POPULATED: yes; Parameters: If >= 2mA; 03. Unit Price: 0.34; 01. Distributor: DigiKey; 02. distributor PN: 754-2031-6-ND
J4 = Jumper: as J5 on sheet Brduino-Main; 01. Distributor: DigiKey; 02. distributor PN: 311-0.0GRDKR-ND
Q1 = MOSFET-N-D: MOSFET N-CHANNEL 30V 1A SC70; 04. Manufacturer: NEXPERIA; 05. Manufacturer PN: PMF250XNEX; POPULATED: yes; 03. Unit Price: 0.31; 01. Distributor: DigiKey; 02. distributor PN: 1727-2693-6-ND
R20 = RES1A: as R15 on sheet Brduino-MCU-Main; 01. Distributor: DigiKey; 02. distributor PN: 311-4.7KLRDKR-ND
R25 = RES1A: RES SMD 3.9K OHM 1% 1/16W 0402; 04. Manufacturer: Yageo; 05. Manufacturer PN: RC0402FR-073K9L; POPULATED: yes; Parameters: 1/16W, 50V, 1%; 03. Unit Price: 0.08; 01. Distributor: DigiKey; 02. distributor PN: 311-3.90KLRDKR-ND
U2 = TPS7A8300: IC REG LINEAR POS ADJ 2A 20VQFN; 04. Manufacturer: Texas Instruments; 05. Manufacturer PN: TPS7A8300RGWT; POPULATED: yes; 03. Unit Price: 4.57; 01. Distributor: DigiKey; 02. distributor PN: 296-36510-6-ND

## Nets that join several sheets
3V3: Brduino-Main (J1.17), Brduino-MCU1 (17 pins), Brduino-PwrLin (J4.2 R20.2)
5V: Brduino-Main (J1.27 J1.30 J5.1), Brduino-PwrLin (8 pins)
GND: Brduino-Main (J1.4 J1.29), Brduino-MCU-Main (C16.2 C17.2 J3.5 R16.1), Brduino-MCU1 (20 pins), Brduino-PwrLin (11 pins)
EXTAL0: Brduino-MCU-Main (C16.1 R9.2 Y2.3), Brduino-MCU1 (U1.32)
PTA12: Brduino-Main (J1.10), Brduino-MCU1 (U1.28)
PTA13: Brduino-Main (J1.11), Brduino-MCU1 (U1.29)
PTA19: Brduino-MCU-Main (C17.1 R9.1 Y2.1), Brduino-MCU1 (U1.33)
PTB0: Brduino-Main (J1.19), Brduino-MCU1 (U1.35)
PTB1: Brduino-Main (J1.20), Brduino-MCU1 (U1.36)
PTB2: Brduino-Main (J1.21), Brduino-MCU1 (U1.37)
PTB3: Brduino-Main (J1.22), Brduino-MCU1 (U1.38)
PTB16: Brduino-Main (J1.5), Brduino-MCU1 (U1.39)
PTB17: Brduino-Main (J1.12), Brduino-MCU1 (U1.40)
PTB18: Brduino-Main (J1.28), Brduino-MCU1 (U1.41)
PTB19: Brduino-Main (J1.3), Brduino-MCU1 (U1.42)
PTC0: Brduino-Main (J1.23), Brduino-MCU1 (U1.43)
PTC1: Brduino-Main (J1.26), Brduino-MCU1 (U1.44)
PTC2: Brduino-Main (J1.25), Brduino-MCU1 (U1.45)
PTC3: Brduino-Main (J1.6), Brduino-MCU1 (U1.46)
PTC4: Brduino-Main (J1.9), Brduino-MCU1 (U1.49)
PTC6: Brduino-MCU-Main (R15.1 R16.2), Brduino-MCU1 (U1.51)
PTD1: Brduino-Main (J1.24), Brduino-MCU1 (U1.58)
PTD2: Brduino-Main (J1.8), Brduino-MCU1 (U1.59)
PTD3: Brduino-Main (J1.7), Brduino-MCU1 (U1.60)
PTD4: Brduino-Main (J1.13), Brduino-MCU1 (U1.61)
PTD5: Brduino-Main (J1.16), Brduino-MCU1 (U1.62)
PTD6: Brduino-Main (J1.14), Brduino-MCU1 (U1.63)
PTD7: Brduino-Main (J1.15), Brduino-MCU1 (U1.64)
PTE0: Brduino-Main (J1.1), Brduino-MCU1 (U1.1)
PTE1: Brduino-Main (J1.2), Brduino-MCU1 (U1.2)
USB-D_N: Brduino-MCU-Main (J3.2), Brduino-MCU1 (U1.6)
USB-D_P: Brduino-MCU-Main (J3.3), Brduino-MCU1 (U1.5)
V-USB: Brduino-Main (J5.2), Brduino-MCU-Main (J3.1 R15.2), Brduino-MCU1 (D1.1)
VREF: Brduino-Main (J1.18), Brduino-MCU1 (C12.1 U1.17)

## Assembly variants
Main Variant: not fitted R11 R13 R16 R50_2 R52_1 R52_2 R54_1 R54_2 R87 R89 R91